# Altium schematic sheet Board Overview.SchDoc
size A4; SheetNumber: 1; SheetTotal: 10
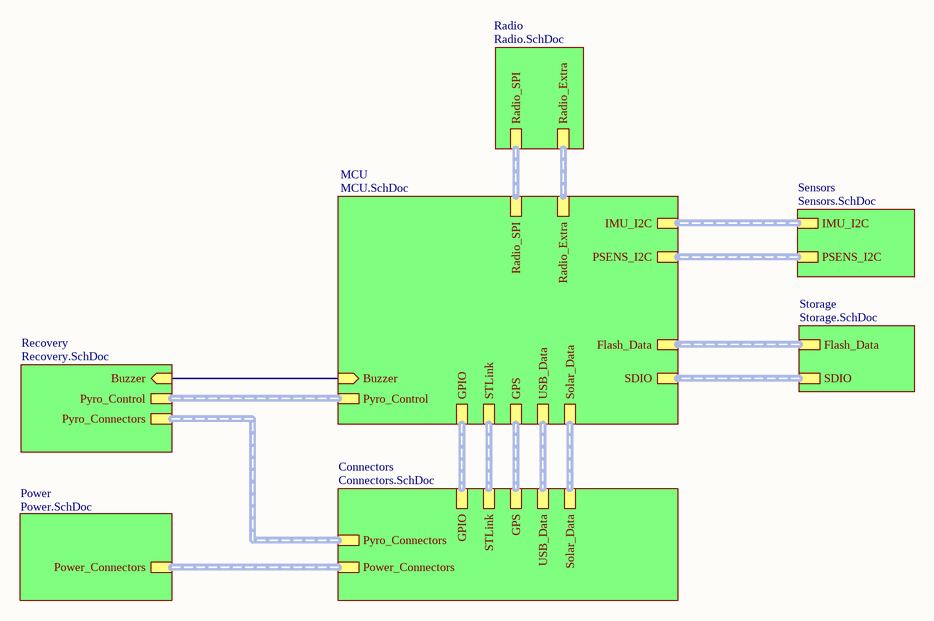
[diagram p0: Board Overview.SchDoc]

## Sub-sheets
Connectors = Connectors.SchDoc: USB_Data (harness USB_Data), Pyro_Connectors (harness Pyro_Connectors), GPS (harness GPS), Power_Connectors (harness Power_Connectors), Solar_Data (harness Solar_Data), STLink (harness STLink), GPIO (harness GPIO)
MCU = MCU.SchDoc: USB_Data (harness USB_Data), Flash_Data (harness Flash_Data), SDIO (harness SDIO), PSENS_I2C (harness PSENS_I2C), IMU_I2C (harness IMU_I2C), Radio_SPI (harness Radio_SPI), Radio_Extra (harness Radio_extra), Pyro_Control (harness Pyro_Control), GPS (harness GPS), Buzzer (in), Solar_Data (harness Solar_Data), STLink (harness STLink), GPIO (harness GPIO)
Power = Power.SchDoc: Power_Connectors (harness Power_Connectors)
Radio = Radio.SchDoc: Radio_SPI (harness Radio_SPI), Radio_Extra (harness Radio_extra)
Recovery = Recovery.SchDoc: Pyro_Connectors (harness Pyro_Connectors), Pyro_Control (harness Pyro_Control), Buzzer (in)
Sensors = Sensors.SchDoc: IMU_I2C (harness IMU_I2C), PSENS_I2C (harness PSENS_I2C)
Storage = Storage.SchDoc: Flash_Data (harness Flash_Data), SDIO (harness SDIO)

## Nets
(unnamed): sheet MCU/Buzzer, sheet Recovery/Buzzer

## Buses and harness runs
harness sheet Connectors/GPIO = sheet MCU/GPIO
harness sheet Connectors/GPS = sheet MCU/GPS
harness sheet Connectors/Power_Connectors = sheet Power/Power_Connectors
harness sheet Connectors/Pyro_Connectors = sheet Recovery/Pyro_Connectors
harness sheet Connectors/Solar_Data = sheet MCU/Solar_Data
harness sheet Connectors/STLink = sheet MCU/STLink
harness sheet Connectors/USB_Data = sheet MCU/USB_Data
harness sheet MCU/Flash_Data = sheet Storage/Flash_Data
harness sheet MCU/IMU_I2C = sheet Sensors/IMU_I2C
harness sheet MCU/PSENS_I2C = sheet Sensors/PSENS_I2C
harness sheet MCU/Pyro_Control = sheet Recovery/Pyro_Control
harness sheet MCU/Radio_Extra = sheet Radio/Radio_Extra
harness sheet MCU/Radio_SPI = sheet Radio/Radio_SPI
harness sheet MCU/SDIO = sheet Storage/SDIO